# Altium schematic sheet can_comparators.SchDoc
size A4; DocumentNumber: 2; SheetNumber: 2; SheetTotal: 5
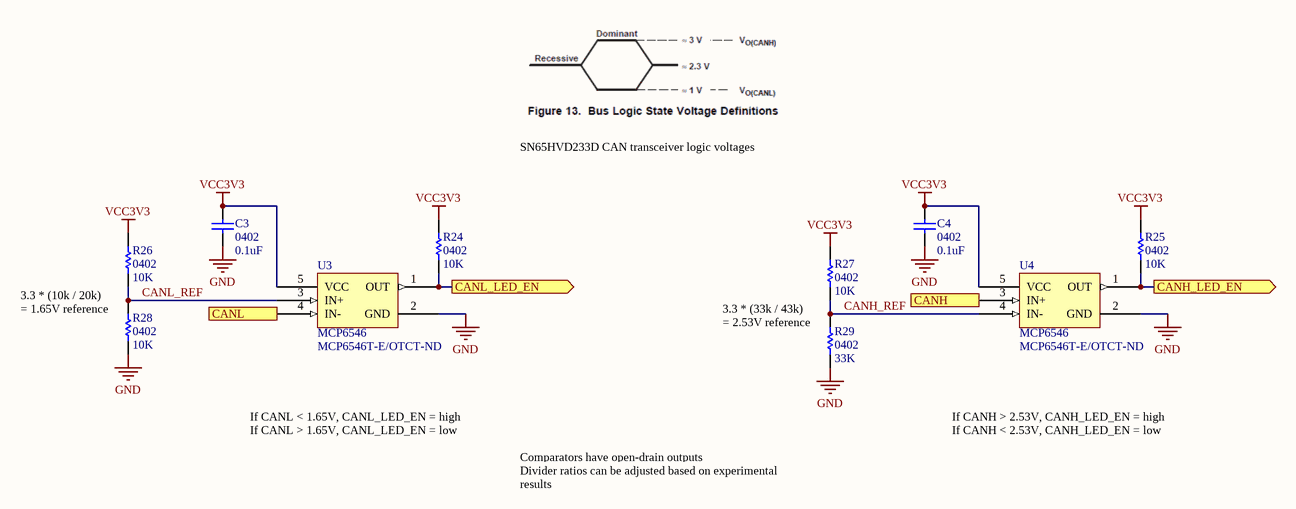
[diagram p0: can_comparators.SchDoc]

## Parts
C3  0402  value 0.1uF  [CAP0402R]
C4  0402  value 0.1uF  [CAP0402R]
R24  0402  value 10K  [RES0402R]
R25  0402  value 10K  [RES0402R]
R26  0402  value 10K  [RES0402R]
R27  0402  value 10K  [RES0402R]
R28  0402  value 10K  [RES0402R]
R29  0402  value 33K  [RES0402R]
U3  MCP6546  Supplier Part Number 1: MCP6546T-E/OTCT-ND  [SOT95P290X160-5N]
U4  MCP6546  Supplier Part Number 1: MCP6546T-E/OTCT-ND  [SOT95P290X160-5N]

## Ports
CANH (in), CANH_LED_EN (out), CANL (in), CANL_LED_EN (out)

## Nets
GND: C3.1 C4.1 R28.1 R29.1 U3.2(GND) U4.2(GND)
VCC3V3: C3.2 C4.2 R24.2 R25.2 R26.2 R27.2 U3.5(VCC) U4.5(VCC)
CANH: U4.3(IN+) ; port CANH
CANH_LED_EN: R25.1 U4.1(OUT) ; port CANH_LED_EN
CANH_REF: R27.1 R29.2 U4.4(IN-)
CANL: U3.4(IN-) ; port CANL
CANL_LED_EN: R24.1 U3.1(OUT) ; port CANL_LED_EN
CANL_REF: R26.1 R28.2 U3.3(IN+)

## Notes on the sheet
- SN65HVD233D CAN transceiver logic voltages
- 3.3 * (10k / 20k)
  = 1.65V reference
- 3.3 * (33k / 43k)
  = 2.53V reference
- If CANL < 1.65V, CANL_LED_EN = high
  If CANL > 1.65V, CANL_LED_EN = low
- If CANH > 2.53V, CANH_LED_EN = high
  If CANH < 2.53V, CANH_LED_EN = low
- Comparators have open-drain outputs
- Divider ratios can be adjusted based on experimental results

## Library data of the parts
C3 C4 = CAP0402: 0402 capacitor
R24-R29 = RES0402: 0402 resistor
U3 U4 = MCP6546: Open-drain output sub-microamp comparator.; Supplier 1: Digi-Key